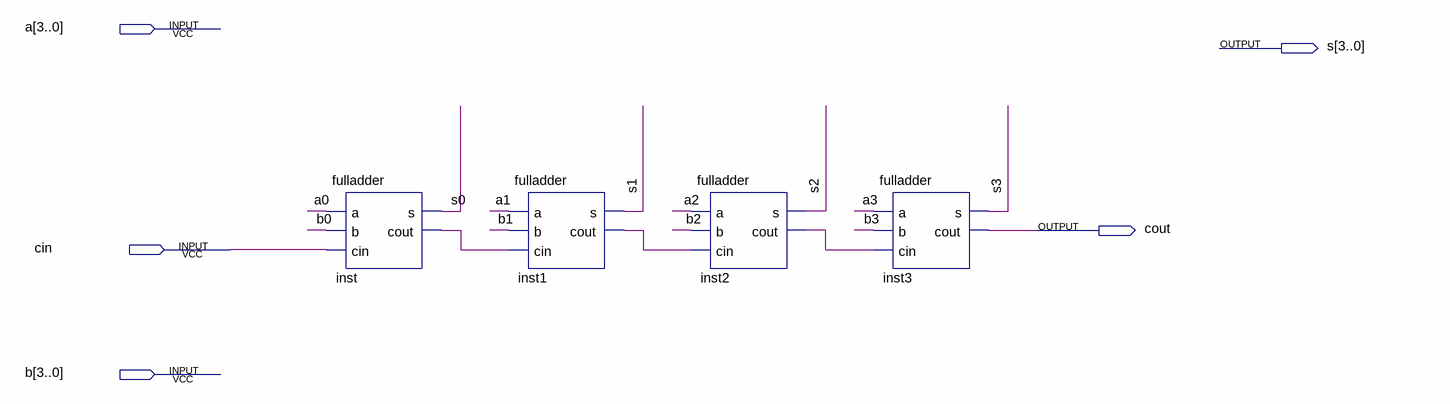
[diagram p0: schematic sheet]
// Quartus schematic somador4bits.bdf as structural Verilog: 4 symbols, 5 pins
module somador4bits (
  input  [3:0] a,
  input  cin,
  input  [3:0] b,
  output [3:0] s,
  output cout
);

  wire inst1_cout, inst2_cout, inst_cout;

  fulladder inst (.a(a[0]), .b(b[0]), .cin(cin), .s(s[0]), .cout(inst_cout));
  fulladder inst1 (.a(a[1]), .b(b[1]), .cin(inst_cout), .s(s[1]), .cout(inst1_cout));
  fulladder inst2 (.a(a[2]), .b(b[2]), .cin(inst1_cout), .s(s[2]), .cout(inst2_cout));
  fulladder inst3 (.a(a[3]), .b(b[3]), .cin(inst2_cout), .s(s[3]), .cout(cout));
endmodule
